# Altium schematic sheet SIM800_Module.SchDoc
size A
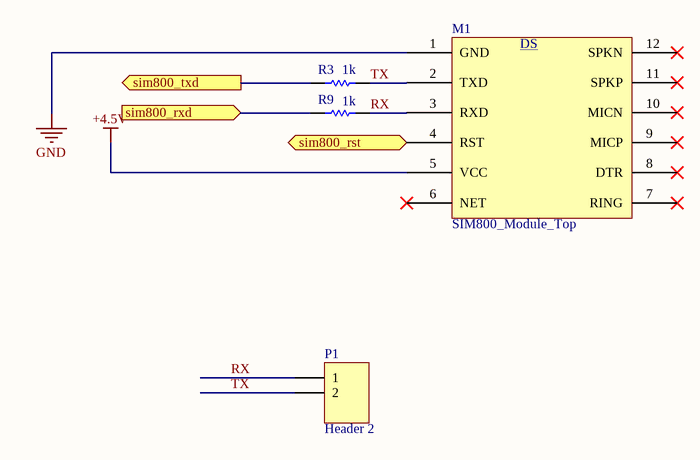
[diagram p0: SIM800_Module.SchDoc]

## Parts
M1  SIM800_Module_Top  [SIM800_Module_Top]
P1  Header 2  [HDR1X2]
R3  value 1k  [R-805]  (hidden comment: R-805)
R9  value 1k  [R-805]  (hidden comment: R-805)

## Ports
sim800_rst (in), sim800_rxd (in), sim800_txd (out)

## Nets
+4.5V: M1.5(VCC)
GND: M1.1(GND)
RX: M1.3(RXD) P1.1 R9.1
sim800_rst: M1.4(RST) ; port sim800_rst
sim800_rxd: R9.2 ; port sim800_rxd
sim800_txd: R3.2 ; port sim800_txd
TX: M1.2(TXD) P1.2 R3.1

Not connected (* = marked no-connect by the designer): M1 6(NET)* 7(RING)* 8(DTR)* 9(MICP)* 10(MICN)* 11(SPKP)* 12(SPKN)*

## Notes on the sheet
- (in symbol SIM800_Module_Top) DS

## Library data of the parts
P1 = Header 2: Header, 3-Pin; LatestRevisionDate: 17-Jul-2002; LatestRevisionNote: Re-released for DXP Platform.; Publisher: Altium Limited
R3 R9 = R-805: Resistor